# Altium project RF Oscillator - R5.PrjPcb
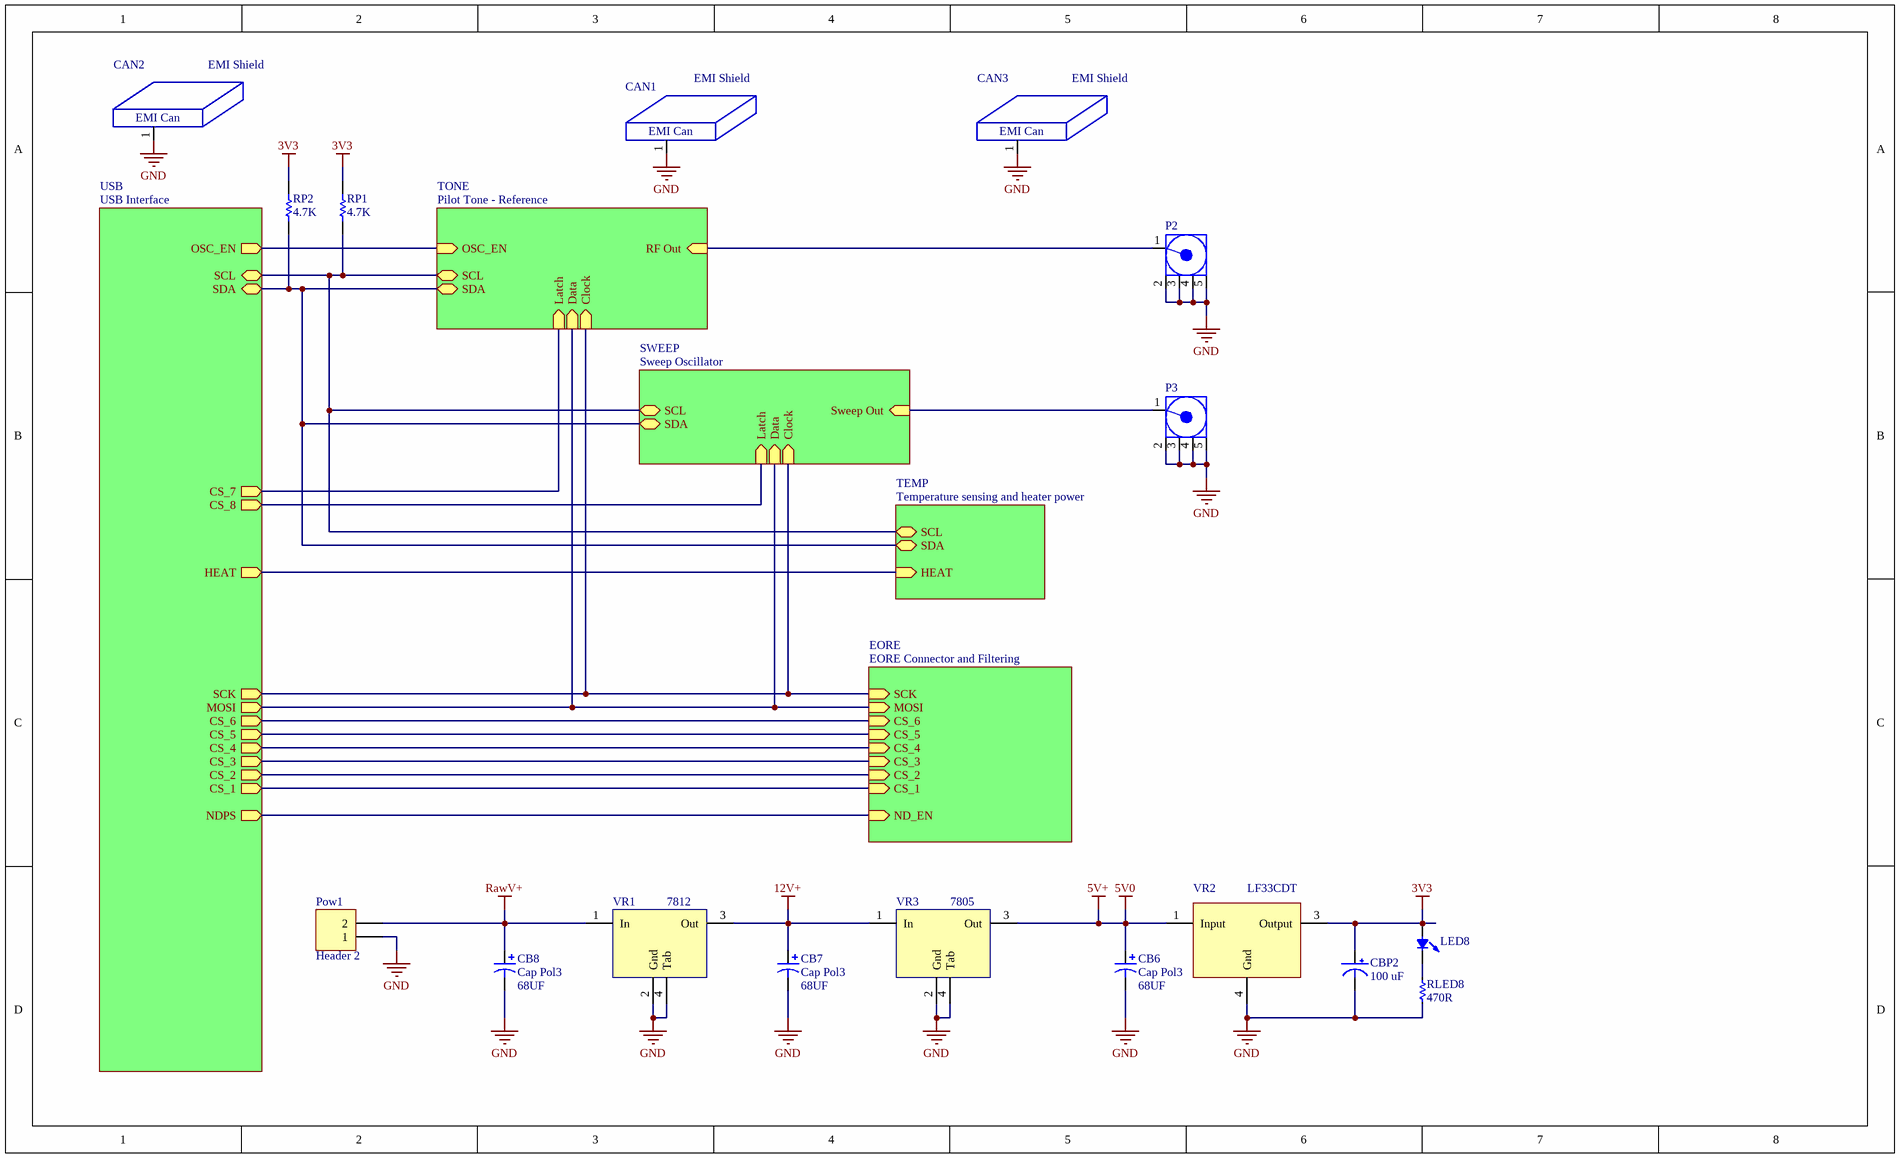
[diagram p0: Main.SchDoc]
5 sheets, 122 parts. Net scope: hierarchical (ports join the sheet entries above them; power ports are global).
Board file: Main.PcbDoc
Sheets:
  Main.SchDoc
    USB = USB Interface.SchDoc
    TEMP = Temperature sensing and heater power.SchDoc
    TONE = Pilot Tone - Reference.SchDoc
    SWEEP = Sweep Oscillator.SchDoc

## Sheet Main.SchDoc
size Legal

### Parts
CAN1  EMI Shield  [BMI-S-205-F]
CAN2  EMI Shield  [BMI-S-230-F]
CAN3  EMI Shield  [BMI-S-230-F]
CB6  Cap Pol3  value 68UF  [V]
CB7  Cap Pol3  value 68UF  [V]
CB8  Cap Pol3  value 68UF  [V]
CBP2  100 uF  [B]
LED8  LED0  [0603 SMT LED]  (value not drawn)
P2  COAX-M  [SMA Jack - PCB Edge - MultiSize]  (value not drawn)
P3  COAX-M  [SMA Jack - PCB Edge - MultiSize]  (value not drawn)
Pow1  Header 2  [AMPModu MTE 2 Pin Shrouded Header]
RLED8  value 470R  [0603R]  (hidden comment: Res Semi Small)
RP1  value 4.7K  [0603R]  (hidden comment: Res Semi)
RP2  value 4.7K  [0603R]  (hidden comment: Res Semi)
VR1  7812  [TO-220 - Small Heatsink]
VR2  LF33CDT  [TO228P1000-3_4N]
VR3  7805  [TO-220 - Small Heatsink]

### Sub-sheets
EORE = EORE Connector and Filtering (file not in this document): SCK (in), MOSI (in), CS_1 (in), CS_2 (in), CS_3 (in), CS_4 (in), CS_5 (in), CS_6 (in), ND_EN (in)
SWEEP = Sweep Oscillator: SCL (bidir), SDA (bidir), Clock (in), Data (in), Latch (in), Sweep Out (in)
TEMP = Temperature sensing and heater power: SCL (bidir), SDA (bidir), HEAT (in)
TONE = Pilot Tone - Reference: SCL (bidir), SDA (bidir), OSC_EN (in), Clock (in), Data (in), Latch (in), RF Out (in)
USB = USB Interface: SCL (bidir), SDA (bidir), SCK (out), MOSI (out), CS_1 (out), CS_2 (out), CS_3 (out), CS_4 (out), CS_5 (out), CS_6 (out), NDPS (out), OSC_EN (out), CS_7 (out), HEAT (out), CS_8 (out)

### Nets
3V3: CBP2.1 LED8.1 RP1.2 RP2.2 VR2.3(Output)
5V+: CB6.1 VR2.1(Input) VR3.3(Out)  [also labelled 5V0]
12V+: CB7.1 VR1.3(Out) VR3.1(In)
GND: CAN1.1 CAN2.1 CAN3.1 CB6.2 CB7.2 CB8.2 CBP2.2 P2.2(GND) P2.3(GND) P2.4(GND) P2.5(GND) P3.2(GND) P3.3(GND) P3.4(GND) P3.5(GND) Pow1.1 RLED8.2 VR1.2(Gnd) VR1.4(Tab) VR2.4(Gnd) VR3.2(Gnd) VR3.4(Tab)
RawV+: CB8.1 Pow1.2 VR1.1(In)
Clock: sheet USB/SCK, sheet TONE/Clock, sheet SWEEP/Clock, sheet EORE/SCK
CS_1: sheet USB/CS_1, sheet EORE/CS_1
CS_2: sheet USB/CS_2, sheet EORE/CS_2
CS_3: sheet USB/CS_3, sheet EORE/CS_3
CS_4: sheet USB/CS_4, sheet EORE/CS_4
CS_5: sheet USB/CS_5, sheet EORE/CS_5
CS_6: sheet USB/CS_6, sheet EORE/CS_6
CS_7: sheet USB/CS_7, sheet TONE/Latch
CS_8: sheet USB/CS_8, sheet SWEEP/Latch
Data: sheet USB/MOSI, sheet TONE/Data, sheet SWEEP/Data, sheet EORE/MOSI
HEAT: sheet USB/HEAT, sheet TEMP/HEAT
NDPS: sheet USB/NDPS, sheet EORE/ND_EN
OSC_EN: sheet USB/OSC_EN, sheet TONE/OSC_EN
RF Out: P2.1(Signal) ; sheet TONE/RF Out
SCL: RP1.1 ; sheet USB/SCL, sheet TEMP/SCL, sheet TONE/SCL, sheet SWEEP/SCL
SDA: RP2.1 ; sheet USB/SDA, sheet TEMP/SDA, sheet TONE/SDA, sheet SWEEP/SDA
Sweep Out: P3.1(Signal) ; sheet SWEEP/Sweep Out
NetLED8_2: LED8.2 RLED8.1

### Notes on the sheet
- (in symbol BMI-S-205-F RF/EMI Can) EMI Can
- (in symbol BMI-S-230-F-R RF/EMI Can) EMI Can

### Library data of the parts
CAN1 = BMI-S-205-F RF/EMI Can: Laird Technologies 2-part EMI can; DKPN: Base: 903-1054-1-ND Cover: 903-1017-ND
CAN2 CAN3 = BMI-S-230-F-R RF/EMI Can: Laird Technologies 2-part EMI can; DKPN: Base: 903-1470-1-ND Cover: 903-1471-ND
CB6-CB8 = Cap Pol3: KEMET T520 KO-CAP  Polymer SMT Tantalum; DKPN: 399-3330-1-ND; Voltage: 10V; Type: KEMET T520 KO-CAP  Polymer SMT Tantalum
CBP2 = 100 uf SMT Panasonic Cap
LED8 = LED0: T 1 3/4 LED; Published: 8-Jun-2000; LatestRevisionDate: 08-Jul-2005; LatestRevisionNote: Mech Layer 1 removed.; PackageReference: LED-0; Publisher: Altium Limited
P2 P3 = COAX-M: RF Coaxial PCB Connector, MMCX; Thru-Hole, Vertical Mount Plug,  50 Ohm Impedance; PackageDocument: Rev. A, 16-Jun-1997; PCB_Layout: Complies with manufacturer's recommendation.; DrillSize: Corresponds to nominal value.; Published: 15-Jul-2004; LatestRevisionDate: 15-Jul-2004; LatestRevisionNote: Component Replaced.; DatasheetDocument: 30-May-2003; PackageReference: 908-21103; Publisher: Altium Limited; ComponentLink1Description: Manufacturer Link; ComponentLink1URL: http://www.amphenolrf.com/
Pow1 = Header 2: Header, 2-Pin; LatestRevisionDate: 17-Jul-2002; LatestRevisionNote: Re-released for DXP Platform.; Publisher: Altium Limited
RLED8 = Res Semi Small: Semiconductor Resistor; Published: 8-Jun-2000; LatestRevisionDate: 17-Jul-2002; LatestRevisionNote: Re-released for DXP Platform.; PackageReference: AXIAL-0.5; Publisher: Altium Limited
RP1 RP2 = Res Semi: Semiconductor Resistor; Published: 8-Jun-2000; LatestRevisionDate: 17-Jul-2002; LatestRevisionNote: Re-released for DXP Platform.; PackageReference: AXIAL-0.5; Publisher: Altium Limited
VR1 VR3 = MIC2940: 1.2A Low-Dropout Voltage Regulator; DKPN: 576-1137-ND (5V TO-263); DKPN: 576-1136-ND (5V TO-220)
VR2 = LF33CDT: Very low drop 500 ma voltage regulators; DKPN: 497-1532-1-ND

## Sheet USB Interface.SchDoc
size Tabloid
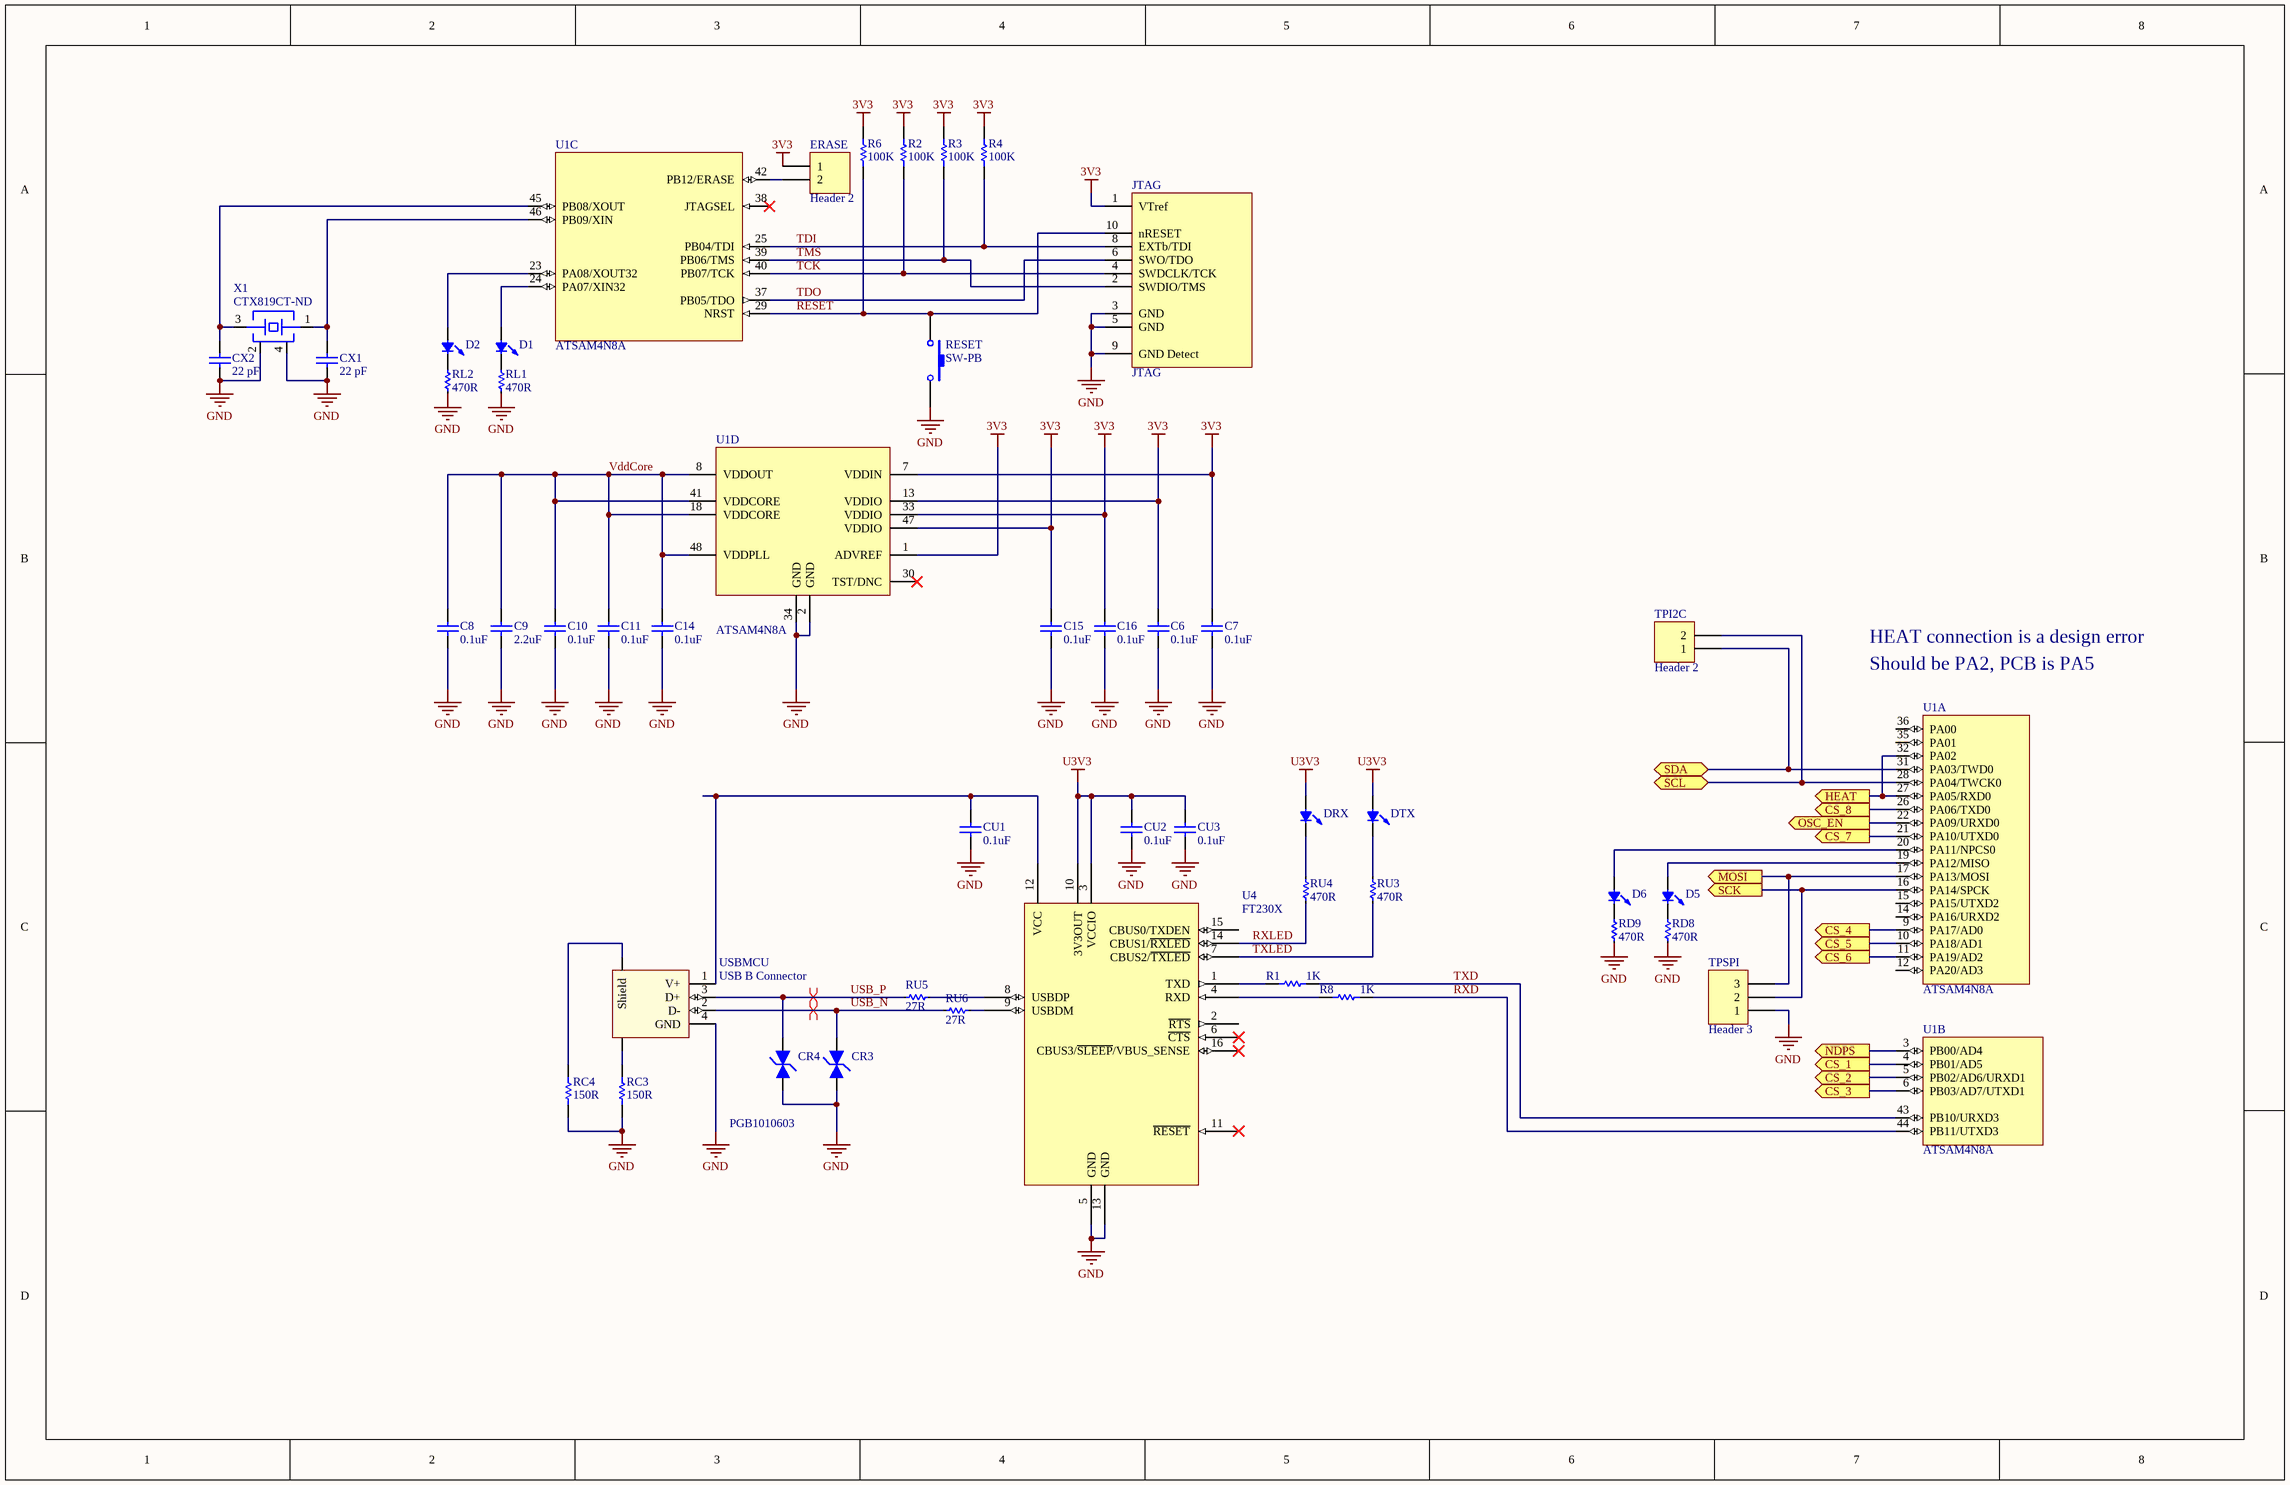
[diagram p1: USB Interface.SchDoc]

### Parts
C6  value 0.1uF  [0603C]  (hidden comment: Cap Semi)
C7  value 0.1uF  [0603C]  (hidden comment: Cap Semi)
C8  value 0.1uF  [0603C]  (hidden comment: Cap Semi)
C9  value 2.2uF  [1206C]  (hidden comment: Cap Semi)
C10  value 0.1uF  [0603C]  (hidden comment: Cap Semi)
C11  value 0.1uF  [0603C]  (hidden comment: Cap Semi)
C14  value 0.1uF  [0603C]  (hidden comment: Cap Semi)
C15  value 0.1uF  [0603C]  (hidden comment: Cap Semi)
C16  value 0.1uF  [0603C]  (hidden comment: Cap Semi)
CR3  PGB1010603  [0603PG]  (value not drawn)
CR4  PGB1010603  [0603PG]
CU1  value 0.1uF  [0603C]  (hidden comment: Cap Semi)
CU2  value 0.1uF  [0603C]  (hidden comment: Cap Semi)
CU3  value 0.1uF  [0603C]  (hidden comment: Cap Semi)
CX1  value 22 pF  [0603C]  (hidden comment: Cap Semi)
CX2  value 22 pF  [0603C]  (hidden comment: Cap Semi)
D1  LED0  [0603 SMT LED]  (value not drawn)
D2  LED0  [0603 SMT LED]  (value not drawn)
D5  LED0  [0603 SMT LED]  (value not drawn)
D6  LED0  [0603 SMT LED]  (value not drawn)
DRX  LED0  [0603 SMT LED]  (value not drawn)
DTX  LED0  [0603 SMT LED]  (value not drawn)
ERASE  Header 2  [HDR1X2]
JTAG  JTAG  [MHDR2X5 - Shrouded]
R1  value 1K  [0603R]  (hidden comment: Res Semi)
R2  value 100K  [0603R]  (hidden comment: Res Semi)
R3  value 100K  [0603R]  (hidden comment: Res Semi)
R4  value 100K  [0603R]  (hidden comment: Res Semi)
R6  value 100K  [0603R]  (hidden comment: Res Semi)
R8  value 1K  [0603R]  (hidden comment: Res Semi)
RC3  value 150R  [1206R]  (hidden comment: Res Semi)
RC4  value 150R  [1206R]  (hidden comment: Res Semi)
RD8  value 470R  [0603R]  (hidden comment: Res Semi Small)
RD9  value 470R  [0603R]  (hidden comment: Res Semi Small)
RESET  SW-PB  [TL3302BF180QG/TR]
RL1  value 470R  [0603R]  (hidden comment: Res Semi Small)
RL2  value 470R  [0603R]  (hidden comment: Res Semi Small)
RU3  value 470R  [0603R]  (hidden comment: Res Semi Small)
RU4  value 470R  [0603R]  (hidden comment: Res Semi Small)
RU5  value 27R  [0603R]  (hidden comment: Res Semi Small)
RU6  value 27R  [0603R]  (hidden comment: Res Semi Small)
TPI2C  Header 2  [HDR1X2]
TPSPI  Header 3  [HDR1X3]
U1  ATSAM4N8A  [TSQFP50P900X900-48N]  (parts A,B,C,D of 4)
U4  FT230X  [SOP635P600-16AN]
USBMCU  USB B Connector  [USB Connector (type B)]
X1  CTX819CT-ND  [Abracon ABM3B Crystal]

### Ports
CS_1 (out), CS_2 (out), CS_3 (out), CS_4 (out), CS_5 (out), CS_6 (out), CS_7 (out), CS_8 (out), HEAT (out), MOSI (out), NDPS (out), OSC_EN (out), SCK (out), SCL (bidir), SDA (bidir)

### Nets
3V3: C6.2 C7.2 C15.2 C16.2 ERASE.1 JTAG.1(VTref) R2.2 R3.2 R4.2 R6.2 U1.1(ADVREF) U1.7(VDDIN) U1.13(VDDIO) U1.33(VDDIO) U1.47(VDDIO)
GND: C6.1 C7.1 C8.1 C9.1 C10.1 C11.1 C14.1 C15.1 C16.1 CR3.2 CR4.2 CU1.1 CU2.1 CU3.1 CX1.1 CX2.1 JTAG.3(GND) JTAG.5(GND) JTAG.9(GND_Detect) RC3.1 RC4.1 RD8.2 RD9.2 RESET.2 RL1.2 RL2.2 TPSPI.1 U1.2(GND) U1.34(GND) U4.5(GND) U4.13(GND) USBMCU.4(GND) X1.2 X1.4
U3V3: CU2.2 CU3.2 DRX.1 DTX.1 U4.3(VCCIO) U4.10(3V3OUT)
Clock: TPSPI.2 U1.16(PA14/SPCK) ; port SCK
CS_1: U1.4(PB01/AD5) ; port CS_1
CS_2: U1.5(PB02/AD6/URXD1) ; port CS_2
CS_3: U1.6(PB03/AD7/UTXD1) ; port CS_3
CS_4: U1.9(PA17/AD0) ; port CS_4
CS_5: U1.10(PA18/AD1) ; port CS_5
CS_6: U1.11(PA19/AD2) ; port CS_6
CS_7: U1.21(PA10/UTXD0) ; port CS_7
CS_8: U1.26(PA06/TXD0) ; port CS_8
Data: TPSPI.3 U1.17(PA13/MOSI) ; port MOSI
HEAT: U1.27(PA05/RXD0) U1.32(PA02) ; port HEAT
NDPS: U1.3(PB00/AD4) ; port NDPS
OSC_EN: U1.22(PA09/URXD0) ; port OSC_EN
RESET: JTAG.10(nRESET) R6.1 RESET.1 U1.29(NRST)
RXD: R8.2 U1.44(PB11/UTXD3)
RXLED: RU4.2 U4.14(CBUS1/~{RXLED})
SCL: TPI2C.2 U1.28(PA04/TWCK0) ; port SCL
SDA: TPI2C.1 U1.31(PA03/TWD0) ; port SDA
TCK: JTAG.4(SWDCLK/TCK) R2.1 U1.40(PB07/TCK)
TDI: JTAG.8(EXTb/TDI) R4.1 U1.25(PB04/TDI)
TDO: JTAG.6(SWO/TDO) U1.37(PB05/TDO)
TMS: JTAG.2(SWDIO/TMS) R3.1 U1.39(PB06/TMS)
TXD: R1.2 U1.43(PB10/URXD3)
TXLED: RU3.2 U4.7(CBUS2/~{TXLED})
USB_N: CR3.1 RU6.1 USBMCU.2(D-)
USB_P: CR4.1 RU5.1 USBMCU.3(D+)
VddCore: C8.2 C9.2 C10.2 C11.2 C14.2 U1.8(VDDOUT) U1.18(VDDCORE) U1.41(VDDCORE) U1.48(VDDPLL)
NetCU1_2: CU1.2 U4.12(VCC) USBMCU.1(V+)
NetCX1_2: CX1.2 U1.46(PB09/XIN) X1.1
NetCX2_2: CX2.2 U1.45(PB08/XOUT) X1.3
NetD1_1: D1.1 U1.24(PA07/XIN32)
NetD1_2: D1.2 RL1.1
NetD2_1: D2.1 U1.23(PA08/XOUT32)
NetD2_2: D2.2 RL2.1
NetD5_1: D5.1 U1.19(PA12/MISO)
NetD5_2: D5.2 RD8.1
NetD6_1: D6.1 U1.20(PA11/NPCS0)
NetD6_2: D6.2 RD9.1
NetDRX_2: DRX.2 RU4.1
NetDTX_2: DTX.2 RU3.1
NetERASE_2: ERASE.2 U1.42(PB12/ERASE)
NetR1_1: R1.1 U4.1(TXD)
NetR8_1: R8.1 U4.4(RXD)
NetRC3_2: RC3.2 USBMCU.5(Gnd)
NetRC4_2: RC4.2 USBMCU.6(Shield)
NetRU5_2: RU5.2 U4.8(NC)
NetRU6_2: RU6.2 U4.9(USBDM)

Not connected (* = marked no-connect by the designer): U1 12(PA20/AD3) 14(PA16/URXD2) 15(PA15/UTXD2) 30(TST/DNC)* 35(PA01) 36(PA00) 38(JTAGSEL)*; U4 2(~{RTS}) 6(~{CTS})* 11(~{RESET})* 15(CBUS0/TXDEN) 16(CBUS3/~{SLEEP}/VBUS_SENSE)* 24(NC)

### Layout directives
differential pair: USB_N, USB_P

### Notes on the sheet
- HEAT connection is a design error
- Should be PA2, PCB is PA5

### Library data of the parts
C6-C11 C14-C16 CU1-CU3 CX1 CX2 = Cap Semi: Capacitor (Semiconductor SIM Model); Published: 8-Jun-2000; LatestRevisionDate: 17-Jul-2002; LatestRevisionNote: Re-released for DXP Platform.; PackageReference: C1206; Publisher: Altium Limited
CR3 CR4 = PGB1010603: PulseGuard® Lead-Free 0603 Surface Mount Polymeric ESD Suppressors
D1 D2 D5 D6 DRX DTX = LED0: T 1 3/4 LED; Published: 8-Jun-2000; LatestRevisionDate: 08-Jul-2005; LatestRevisionNote: Mech Layer 1 removed.; PackageReference: LED-0; Publisher: Altium Limited
ERASE TPI2C = Header 2: Header, 2-Pin; LatestRevisionDate: 17-Jul-2002; LatestRevisionNote: Re-released for DXP Platform.; Publisher: Altium Limited
JTAG = ARM JTAG-10: ARM 10-Pin JTAG Interface
R1-R4 R6 R8 RC3 RC4 = Res Semi: Semiconductor Resistor; Published: 8-Jun-2000; LatestRevisionDate: 17-Jul-2002; LatestRevisionNote: Re-released for DXP Platform.; PackageReference: AXIAL-0.5; Publisher: Altium Limited
RD8 RD9 RL1 RL2 RU3-RU6 = Res Semi Small: Semiconductor Resistor; Published: 8-Jun-2000; LatestRevisionDate: 17-Jul-2002; LatestRevisionNote: Re-released for DXP Platform.; PackageReference: AXIAL-0.5; Publisher: Altium Limited
RESET = SW-PB: Switch; Published: 24-Mar-1999; LatestRevisionDate: 17-Jul-2002; LatestRevisionNote: Re-released for DXP Platform.; PackageReference: SPST-2; Publisher: Altium Limited
TPSPI = Header 3: Header, 3-Pin; LatestRevisionDate: 17-Jul-2002; LatestRevisionNote: Re-released for DXP Platform.; Publisher: Altium Limited
U1 = ATSAM4N8A: SAM4N ARM Cortex-M4 Microcontrollers
U4 = FT230X: USB To Basic Serial Bridge IC; DKPN: 768-1135-1-ND; Datasheet: http://www.ftdichip.com/Support/Documents/DataSheets/ICs/DS_FT230X.pdf
USBMCU = USB B connector - Through hole
X1 = SMT Crystal: 16 MHz Micro SMT Crystal; DKPN: 535-9122-1-ND; MFGPN: ABM3B-16.000MHZ-B2-T; DKDESC: CRYSTAL 16.000MHZ 18PF SMD

## Sheet Temperature sensing and heater power.SchDoc
size A
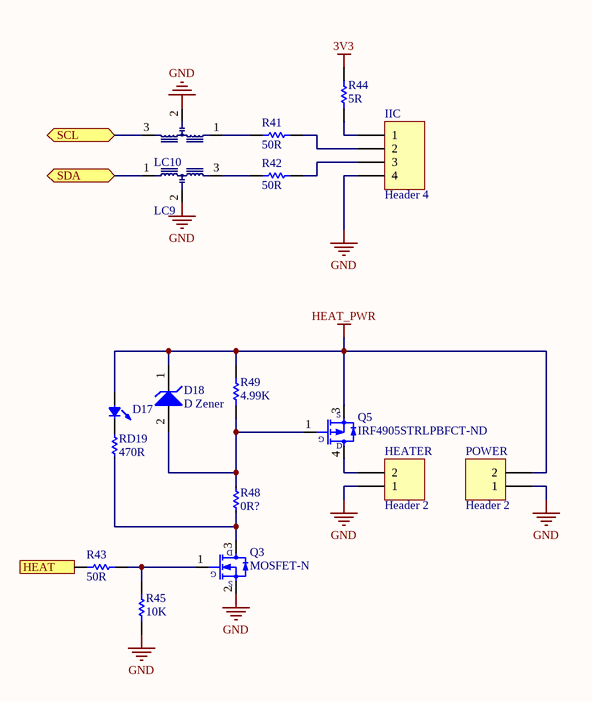
[diagram p2: Temperature sensing and heater power.SchDoc]

### Parts
D17  LED0  [0603 SMT LED]  (value not drawn)
D18  D Zener  [SOD123/X.85]
HEATER  Header 2  [Molex Mini-Fit Jr 5569 - 2 Pin, RA]
IIC  Header 4  [AMPModu MTE 4 Pin Shrouded Header]
LC9  MEM2012F  [MEM2012S LC Filter]  (value not drawn)
LC10  MEM2012F  [MEM2012S LC Filter]  (value not drawn)
POWER  Header 2  [Molex Mini-Fit Jr 5569 - 2 Pin, RA]
Q3  MOSFET-N  [SOT23-3N]
Q5  IRF4905STRLPBFCT-ND  [TO254P1520-3_4N]
R41  value 50R  [0603R]  (hidden comment: Res Semi)
R42  value 50R  [0603R]  (hidden comment: Res Semi)
R43  value 50R  [0603R]  (hidden comment: Res Semi)
R44  value 5R  [1206R]  (hidden comment: Res Semi)
R45  value 10K  [0603R]  (hidden comment: Res Semi)
R48  value 0R?  [0603R]  (hidden comment: Res Semi Small)
R49  value 4.99K  [1206R]  (hidden comment: Res Semi)
RD19  value 470R  [0603R]  (hidden comment: Res Semi Small)

### Ports
HEAT (in), SCL (bidir), SDA (bidir)

### Nets
3V3: R44.2
GND: HEATER.1 IIC.4 LC9.2 LC10.2 POWER.1 Q3.2(S) R45.1
HEAT_PWR: D17.1 D18.1(A) POWER.2 Q5.3(D) R49.2
HEAT: R43.1 ; port HEAT
SCL: LC10.3 ; port SCL
SDA: LC9.1 ; port SDA
NetD17_2: D17.2 RD19.1
NetD18_2: D18.2(K) Q5.1(G) R48.1 R49.1
NetHEATER_2: HEATER.2 Q5.4(S)
NetIIC_1: IIC.1 R44.1
NetIIC_2: IIC.2 R41.2
NetIIC_3: IIC.3 R42.2
NetLC9_3: LC9.3 R42.1
NetLC10_1: LC10.1 R41.1
NetQ3_1: Q3.1(G) R43.2 R45.2
NetQ3_3: Q3.3(D) R48.2 RD19.2

### Library data of the parts
D17 = LED0: T 1 3/4 LED; Published: 8-Jun-2000; LatestRevisionDate: 08-Jul-2005; LatestRevisionNote: Mech Layer 1 removed.; PackageReference: LED-0; Publisher: Altium Limited
D18 = D Zener: Zener Diode; Published: 8-Jun-2000; LatestRevisionDate: 17-Jul-2002; LatestRevisionNote: Re-released for DXP Platform.; PackageReference: DIODE-0.7; Publisher: Altium Limited
HEATER POWER = Header 2: Header, 2-Pin; LatestRevisionDate: 17-Jul-2002; LatestRevisionNote: Re-released for DXP Platform.; Publisher: Altium Limited
IIC = Header 4: Header, 4-Pin; LatestRevisionDate: 17-Jul-2002; LatestRevisionNote: Re-released for DXP Platform.; Publisher: Altium Limited
LC9 LC10 = MEM2012F - Signal Filter: Signal Line 3-terminal Filters
Q3 = MOSFET-N: N-Channel MOSFET; Published: 8-Jun-2000; LatestRevisionDate: 17-Jul-2002; LatestRevisionNote: Re-released for DXP Platform.; PackageVersion: 1995/1996; PackageReference: E3; Publisher: Altium Limited
Q5 = MOSFET-P: P-Channel MOSFET; Published: 8-Jun-2000; LatestRevisionDate: 17-Jul-2002; LatestRevisionNote: Re-released for DXP Platform.; PackageVersion: 1995/1996; PackageReference: E3; Publisher: Altium Limited
R41-R45 R49 = Res Semi: Semiconductor Resistor; Published: 8-Jun-2000; LatestRevisionDate: 17-Jul-2002; LatestRevisionNote: Re-released for DXP Platform.; PackageReference: AXIAL-0.5; Publisher: Altium Limited
R48 RD19 = Res Semi Small: Semiconductor Resistor; Published: 8-Jun-2000; LatestRevisionDate: 17-Jul-2002; LatestRevisionNote: Re-released for DXP Platform.; PackageReference: AXIAL-0.5; Publisher: Altium Limited

## Sheet Pilot Tone - Reference.SchDoc
size Letter
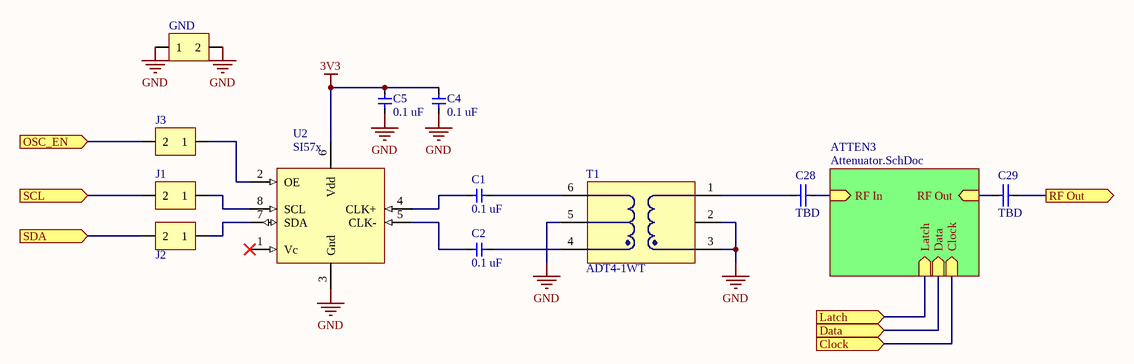
[diagram p3: Pilot Tone - Reference.SchDoc]

### Parts
C1  value 0.1 uF  [0603C]  (hidden comment: SMT Cap)
C2  value 0.1 uF  [0603C]  (hidden comment: SMT Cap)
C4  value 0.1 uF  [0603C]  (hidden comment: SMT Cap)
C5  value 0.1 uF  [0603C]  (hidden comment: SMT Cap)
C28  value TBD  [0402C]  (hidden comment: Cap)
C29  value TBD  [0402C]  (hidden comment: Cap)
GND  Jumper  [HDR1X2]  (value not drawn)
J1  Jumper  [0603R]  (value not drawn)
J2  Jumper  [0603R]  (value not drawn)
J3  Jumper  [0603R]  (value not drawn)
T1  ADT4-1WT  [CD542]
U2  SI57x  [SI57x]

### Sub-sheets
ATTEN3 = Attenuator.SchDoc (file not in this document): RF In (in), RF Out (in), Clock (in), Data (in), Latch (in)

### Ports
Clock (in), Data (in), Latch (in), OSC_EN (in), RF Out (out), SCL (in), SDA (in)

### Nets
3V3: C4.2 C5.2 U2.6(Vdd)
GND: C4.1 C5.1 GND.1 GND.2 T1.2(Gnd) T1.3(Coupled) T1.5(Termination) U2.3(Gnd)
Clock: port Clock, sheet ATTEN3/Clock
CS_7: port Latch, sheet ATTEN3/Latch
Data: port Data, sheet ATTEN3/Data
OSC_EN: J3.2 ; port OSC_EN
RF Out: C29.2 ; port RF Out
SCL: J1.2 ; port SCL
SDA: J2.2 ; port SDA
NetC1_1: C1.1 U2.4(CLK+)
NetC1_2: C1.2 T1.6(Output)
NetC2_1: C2.1 U2.5(CLK-)
NetC2_2: C2.2 T1.4(Termination)
NetC28_1: C28.1 T1.1(Input)
NetC28_2: C28.2 ; sheet ATTEN3/RF In
NetC29_1: C29.1 ; sheet ATTEN3/RF Out
NetJ1_1: J1.1 U2.8(SCL)
NetJ2_1: J2.1 U2.7(SDA)
NetJ3_1: J3.1 U2.2(OE)

Not connected (* = marked no-connect by the designer): U2 1(Vc)*

### Library data of the parts
C1 C2 C4 C5 = Cap - SMT Small: Published: 8-Jun-2000; LatestRevisionDate: 29-May-2009; LatestRevisionNote: IPC-7351 Footprint Added.; PackageReference: C1206; Publisher: Altium Limited; PackageDescription: Chip Capacitor
C28 C29 = Cap: Capacitor; Published: 8-Jun-2000; LatestRevisionDate: 17-Jul-2002; LatestRevisionNote: Re-released for DXP Platform.; PackageReference: RAD-0.3; Publisher: Altium Limited
GND J1-J3 = Jumper - 2 Pin: Jumper - 2-Pin; LatestRevisionDate: 17-Jul-2002; LatestRevisionNote: Re-released for DXP Platform.; Publisher: Altium Limited
T1 = ADT4-1WT: Surface Mount RF Transformer
U2 = SI570: 10 MHZ TO 1.4 GHZ I2C PROGRAMMABLE XO/VCXO

## Sheet Sweep Oscillator.SchDoc
size Tabloid
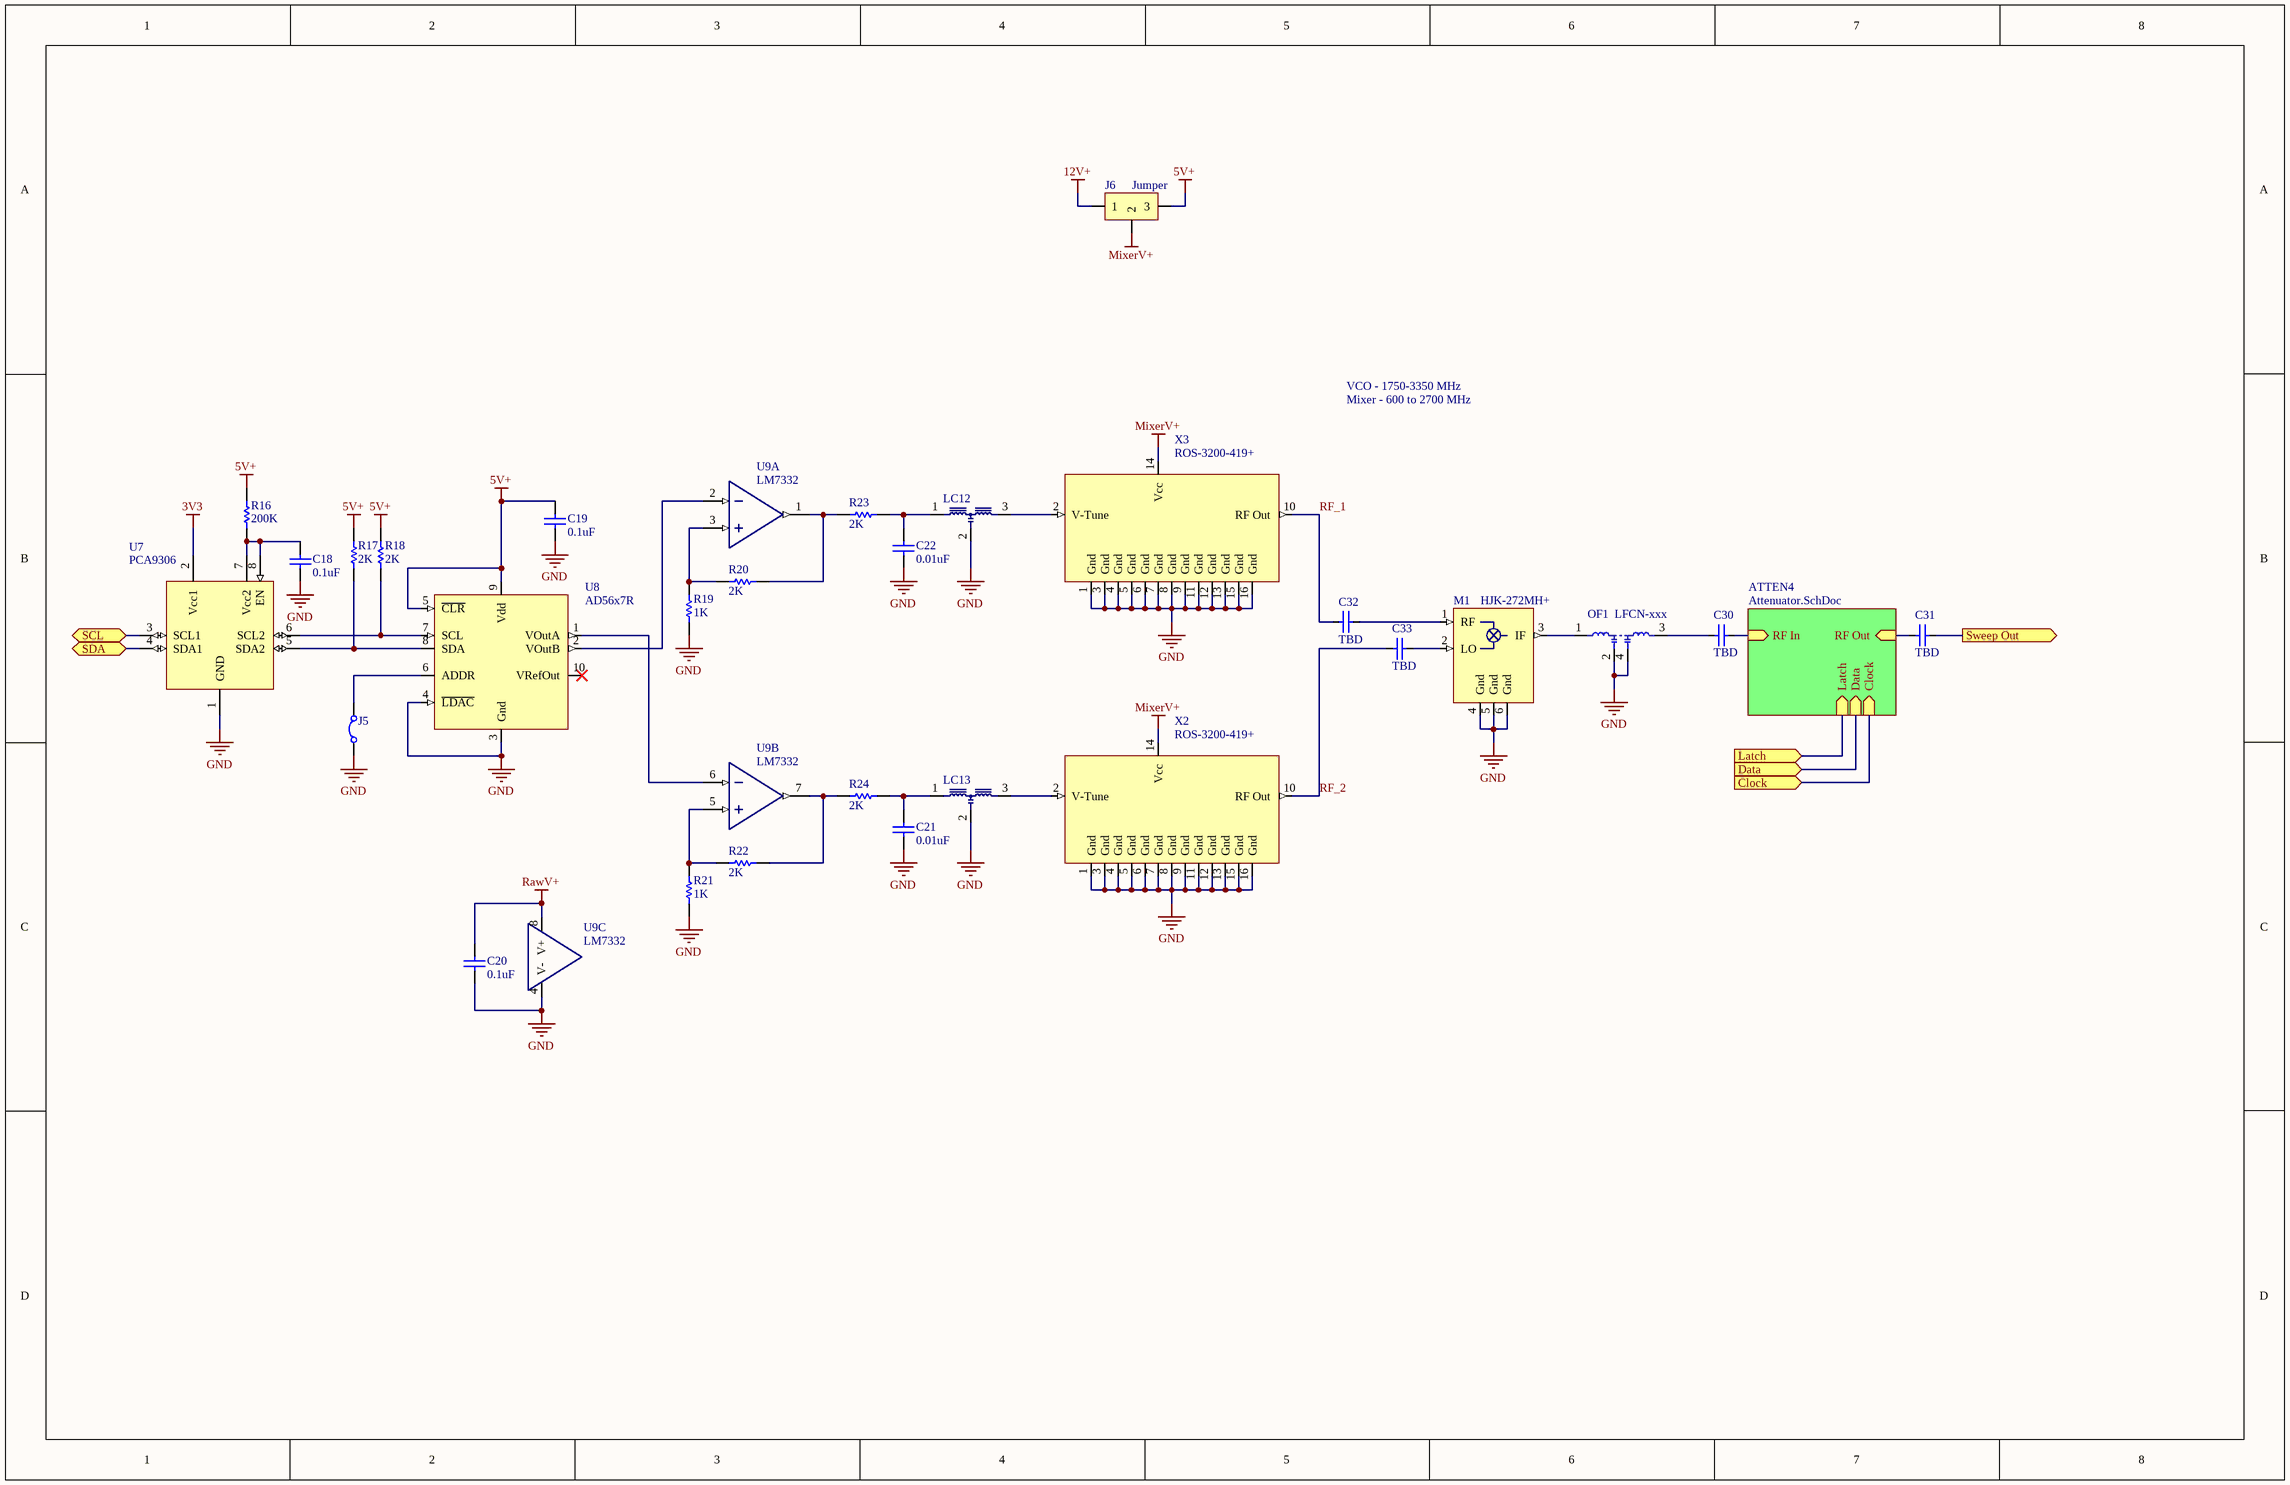
[diagram p4: Sweep Oscillator.SchDoc]

### Parts
C18  value 0.1uF  [0603C]  (hidden comment: Cap Semi)
C19  value 0.1uF  [0603C]  (hidden comment: Cap Semi)
C20  value 0.1uF  [0603C]  (hidden comment: Cap Semi)
C21  value 0.01uF  [0603C]  (hidden comment: Cap Semi)
C22  value 0.01uF  [0603C]  (hidden comment: Cap Semi)
C30  value TBD  [0402C]  (hidden comment: Cap)
C31  value TBD  [0402C]  (hidden comment: Cap)
C32  value TBD  [0402C]  (hidden comment: Cap)
C33  value TBD  [0402C]  (hidden comment: Cap)
J5  (no value)  [0603R]
J6  Jumper  [HDR1X3]
LC12  MEM2012F  [MEM2012S LC Filter]  (value not drawn)
LC13  MEM2012F  [MEM2012S LC Filter]  (value not drawn)
M1  HJK-272MH+  [TTT881]
OF1  LFCN-xxx  [FV1206]
R16  value 200K  [0603R]  (hidden comment: Res Semi)
R17  value 2K  [0603R]  (hidden comment: Res Semi)
R18  value 2K  [0603R]  (hidden comment: Res Semi)
R19  value 1K  [0603R]  (hidden comment: Res Semi)
R20  value 2K  [0603R]  (hidden comment: Res Semi)
R21  value 1K  [0603R]  (hidden comment: Res Semi)
R22  value 2K  [0603R]  (hidden comment: Res Semi)
R23  value 2K  [0603R]  (hidden comment: Res Semi)
R24  value 2K  [0603R]  (hidden comment: Res Semi)
U7  PCA9306  [TSOP65P490-8AN]
U8  AD56x7R  [TSSOP50P490-10AN]
U9  LM7332  [SOIC127P600-8CN]  (parts A,B,C of 3)
X2  ROS-3200-419+  [CK605]
X3  ROS-3200-419+  [CK605]

### Sub-sheets
ATTEN4 = Attenuator.SchDoc (file not in this document): RF In (in), RF Out (in), Clock (in), Data (in), Latch (in)

### Ports
Clock (in), Data (in), Latch (in), SCL (bidir), SDA (bidir), Sweep Out (out)

### Nets
3V3: U7.2(Vcc1)
5V+: C19.2 J6.3 R16.2 R17.2 R18.2 U8.5(~{CLR}) U8.9(Vdd)
12V+: J6.1
GND: C18.1 C19.1 C20.1 C21.1 C22.1 J5.1(C1) LC12.2 LC13.2 M1.4(Gnd) M1.5(Gnd) M1.6(Gnd) OF1.2 OF1.4 R19.2 R21.1 U7.1(GND) U8.3(Gnd) U8.4(~{LDAC}) U9.4(V-) X2.1(Gnd) X2.3(Gnd) X2.4(Gnd) X2.5(Gnd) X2.6(Gnd) X2.7(Gnd) X2.8(Gnd) X2.9(Gnd) X2.11(Gnd) X2.12(Gnd) X2.13(Gnd) X2.15(Gnd) X2.16(Gnd) X3.1(Gnd) X3.3(Gnd) X3.4(Gnd) X3.5(Gnd) X3.6(Gnd) X3.7(Gnd) X3.8(Gnd) X3.9(Gnd) X3.11(Gnd) X3.12(Gnd) X3.13(Gnd) X3.15(Gnd) X3.16(Gnd)
MixerV+: J6.2 X2.14(Vcc) X3.14(Vcc)
RawV+: C20.2 U9.8(V+)
Clock: port Clock, sheet ATTEN4/Clock
CS_8: port Latch, sheet ATTEN4/Latch
Data: port Data, sheet ATTEN4/Data
RF_1: C32.1 X3.10(RF_Out)
RF_2: C33.1 X2.10(RF_Out)
SCL: U7.3(SCL1) ; port SCL
SDA: U7.4(SDA1) ; port SDA
Sweep Out: C31.2 ; port Sweep Out
NetC18_2: C18.2 R16.1 U7.7(Vcc2) U7.8(EN)
NetC21_2: C21.2 LC13.1 R24.1
NetC22_2: C22.2 LC12.1 R23.1
NetC30_1: C30.1 OF1.3
NetC30_2: C30.2 ; sheet ATTEN4/RF In
NetC31_1: C31.1 ; sheet ATTEN4/RF Out
NetC32_2: C32.2 M1.1(RF)
NetC33_2: C33.2 M1.2(LO)
NetJ5_2: J5.2(C2) U8.6(ADDR)
NetLC12_3: LC12.3 X3.2(V-Tune)
NetLC13_3: LC13.3 X2.2(V-Tune)
NetM1_3: M1.3(IF) OF1.1
NetR17_1: R17.1 U7.5(SDA2) U8.8(SDA)
NetR18_1: R18.1 U7.6(SCL2) U8.7(SCL)
NetR19_1: R19.1 R20.1 U9.3(In_A_+)
NetR20_2: R20.2 R23.2 U9.1(Out_A)
NetR21_2: R21.2 R22.2 U9.5(In_B_+)
NetR22_1: R22.1 R24.2 U9.7(Out_B)
NetU8_1: U8.1(VOutA) U9.6(In_B_-)
NetU8_2: U8.2(VOutB) U9.2(In_A_-)

Not connected (* = marked no-connect by the designer): U8 10(VRefOut)*

### Notes on the sheet
- VCO - 1750-3350 MHz
- Mixer - 600 to 2700 MHz

### Library data of the parts
C18-C22 = Cap Semi: Capacitor (Semiconductor SIM Model); Published: 8-Jun-2000; LatestRevisionDate: 17-Jul-2002; LatestRevisionNote: Re-released for DXP Platform.; PackageReference: C1206; Publisher: Altium Limited
C30-C33 = Cap: Capacitor; Published: 8-Jun-2000; LatestRevisionDate: 17-Jul-2002; LatestRevisionNote: Re-released for DXP Platform.; PackageReference: RAD-0.3; Publisher: Altium Limited
J5 = Jumper - SMT Resistor
J6 = Jumper - 3 Pin: Jumper - 3-Pin; LatestRevisionDate: 17-Jul-2002; LatestRevisionNote: Re-released for DXP Platform.; Publisher: Altium Limited
LC12 LC13 = MEM2012F - Signal Filter: Signal Line 3-terminal Filters
M1 = HJK-272MH+: Wideband Frequency Mixer Level 13 (LO Power +13 dBm) 600 to 2700 MHz
OF1 = LFCN-xxx Filter: Ceramic Low Pass Filter
R16-R24 = Res Semi: Semiconductor Resistor; Published: 8-Jun-2000; LatestRevisionDate: 17-Jul-2002; LatestRevisionNote: Re-released for DXP Platform.; PackageReference: AXIAL-0.5; Publisher: Altium Limited
U7 = PCA9306: Dual bidirectional I2C-bus and SMBus voltage-level translator
U8 = AD56x7R: Dual, 12-/14-/16-Bit nanoDACs® with  5 ppm/°C On-Chip Reference, I2C Interface
U9 = LM7332: Dual Rail-to-Rail Input/Output, 30V, Wide Voltage Range, High Output Operational Amplifier; Datasheet: http://www.analog.com/static/imported-files/data_sheets/AD822.pdf
X2 X3 = ROS-2650 VCO: Linear Tuning 2165 to 2650 MHz SMT Voltage Controlled Oscillator

## Nets that join several sheets
3V3: Main (5 pins), USB Interface (15 pins), Temperature sensing and heater power (R44.2), Pilot Tone - Reference (C4.2 C5.2 U2.6), Sweep Oscillator (U7.2)
5V+: Main (CB6.1 VR2.1 VR3.3), Sweep Oscillator (7 pins)
12V+: Main (CB7.1 VR1.3 VR3.1), Sweep Oscillator (J6.1)
GND: Main (22 pins), USB Interface (34 pins), Temperature sensing and heater power (7 pins), Pilot Tone - Reference (8 pins), Sweep Oscillator (45 pins)
RawV+: Main (CB8.1 Pow1.2 VR1.1), Sweep Oscillator (C20.2 U9.8)
HEAT: USB Interface (U1.27 U1.32), Temperature sensing and heater power (R43.1)
OSC_EN: USB Interface (U1.22), Pilot Tone - Reference (J3.2)
RF Out: Main (P2.1), Pilot Tone - Reference (C29.2)
SCL: Main (RP1.1), USB Interface (TPI2C.2 U1.28), Temperature sensing and heater power (LC10.3), Pilot Tone - Reference (J1.2), Sweep Oscillator (U7.3)
SDA: Main (RP2.1), USB Interface (TPI2C.1 U1.31), Temperature sensing and heater power (LC9.1), Pilot Tone - Reference (J2.2), Sweep Oscillator (U7.4)
Sweep Out: Main (P3.1), Sweep Oscillator (C31.2)